# EAGLE design mainboard (EAGLE 7.1.0)
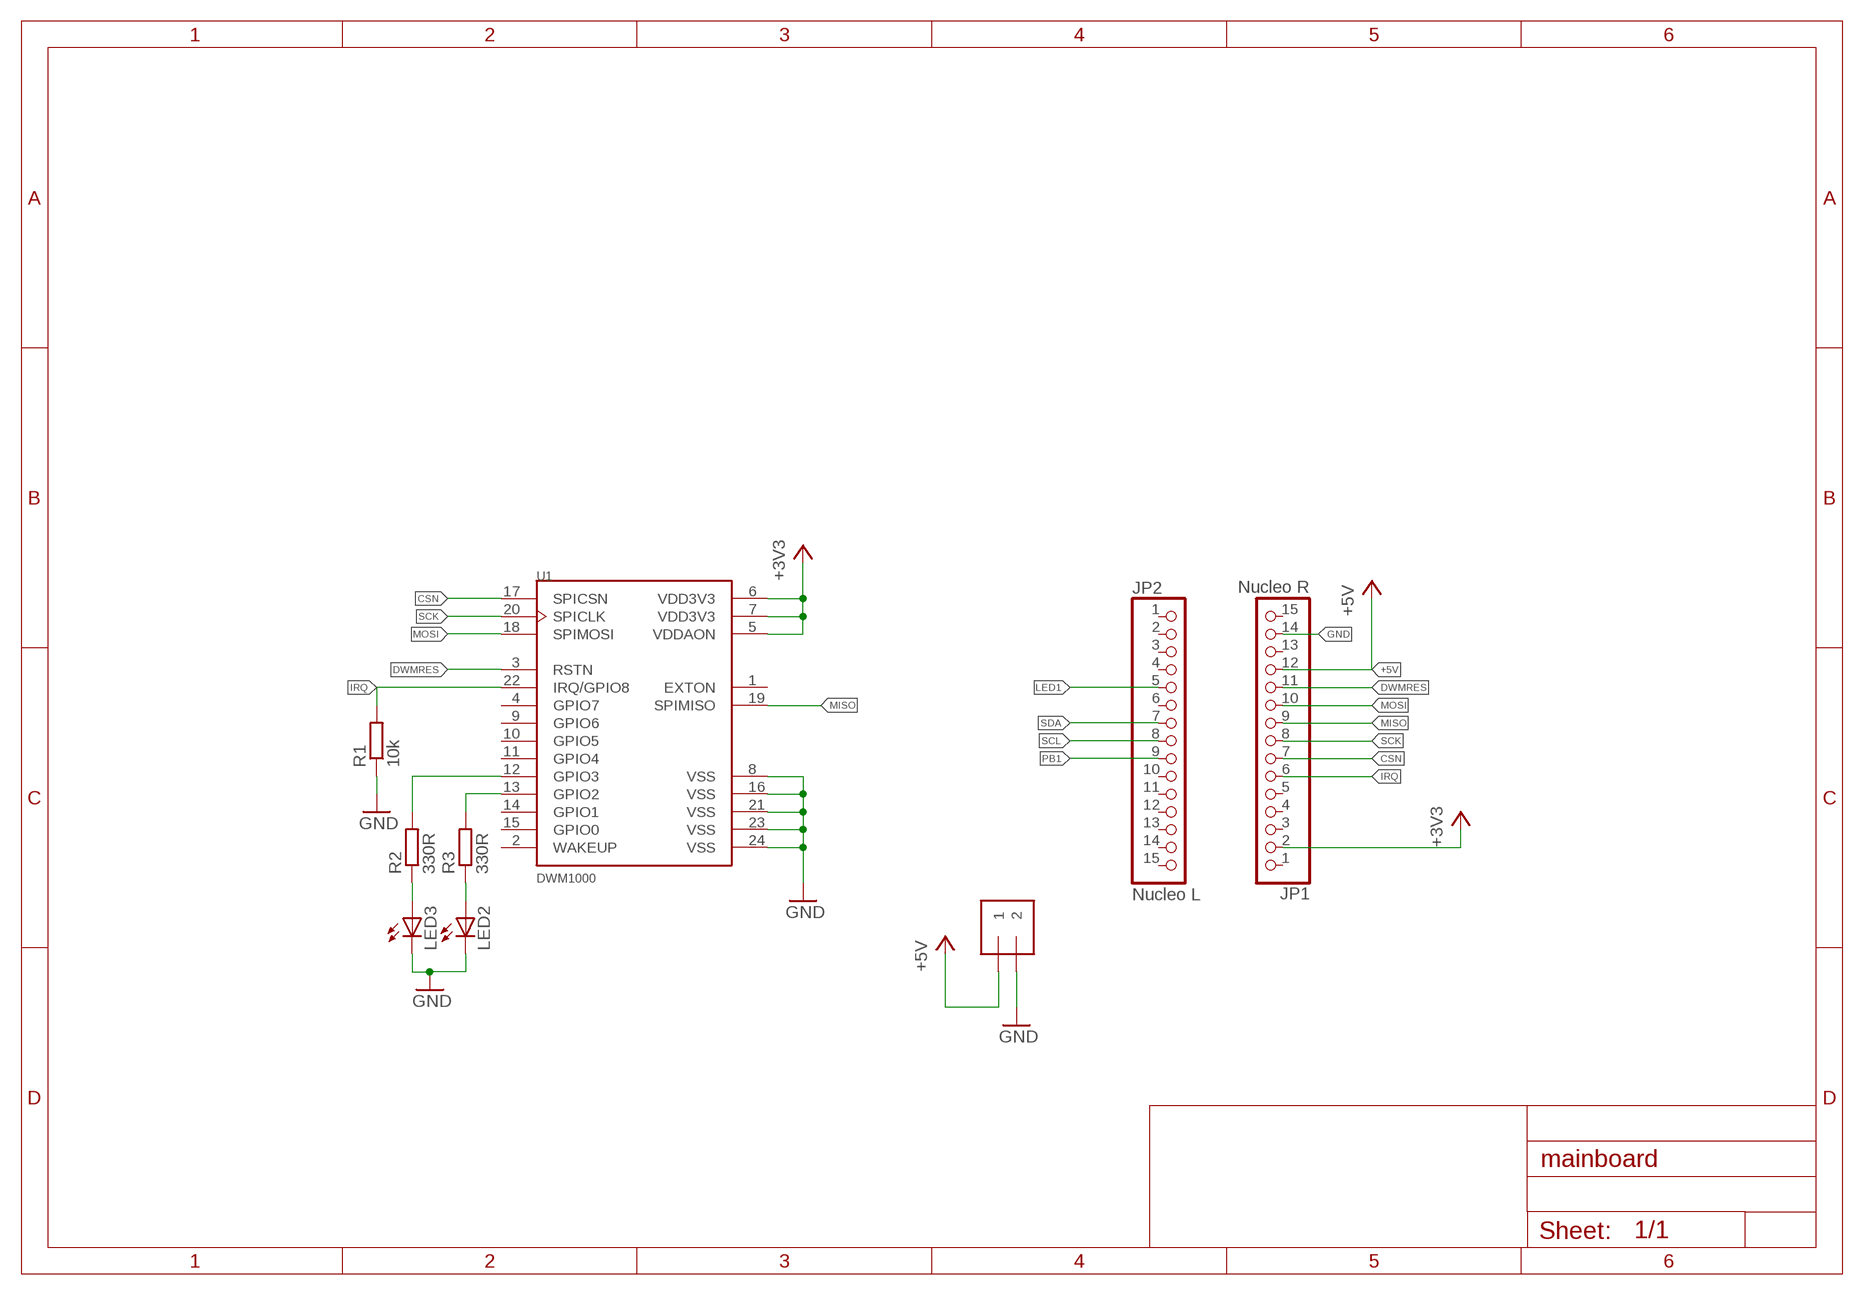
[diagram p0: schematic, sheet 1]

## Parts
J1  1X2-3.5MM  [1X2-3.5MM]
JP1  Nucleo R  PINHD-1X15  [1X15]
JP2  Nucleo L  PINHD-1X15  [1X15]
LED2  LEDSML0603  [SML0603]
LED3  LEDSML0603  [SML0603]
R1  10k  R-EU_R0603  [R0603]
R2  330R  R-EU_R0603  [R0603]
R3  330R  R-EU_R0603  [R0603]
U1  DWM1000  [XCVR_DWM1000]

## Nets
+3V3: JP1.2 U1.5(VDDAON) U1.6(VDD3V3) U1.7(VDD3V3)
+5V: J1.1 JP1.12
CSN: JP1.7 U1.17(SPICSN)
DWMRES: JP1.11 U1.3(RSTN)
GND: J1.2 JP1.14 LED2.C LED3.C R1.1 U1.8(VSS) U1.16(VSS) U1.21(VSS) U1.23(VSS) U1.24(VSS)
IRQ: JP1.6 R1.2 U1.22(IRQ/GPIO8)
LED1: JP2.5
MISO: JP1.9 U1.19(SPIMISO)
MOSI: JP1.10 U1.18(SPIMOSI)
N$2: R3.2 U1.13(GPIO2)
N$3: R2.2 U1.12(GPIO3)
N$5: LED2.A R3.1
N$6: LED3.A R2.1
PB1: JP2.9
SCK: JP1.8 U1.20(SPICLK)
SCL: JP2.8
SDA: JP2.7
Unconnected: JP1.1 JP1.3 JP1.4 JP1.5 JP1.13 JP1.15 JP2.1 JP2.2 JP2.3 JP2.4 JP2.6 JP2.10 JP2.11 JP2.12 JP2.13 JP2.14 JP2.15 U1.1(EXTON) U1.2(WAKEUP) U1.4(GPIO7) U1.9(GPIO6) U1.10(GPIO5) U1.11(GPIO4) U1.14(GPIO1) U1.15(GPIO0)

## Library data of the parts
J1 = adafruit:1X2: 3.5mm Terminal block http://www.ladyada.net/library/pcb/eaglelibrary.html
JP1 JP2 = pinhead:PINHD-1X15: PIN HEADER
LED2 LED3 = led:LED: LED OSRAM: - CHIPLED LG R971, LG N971, LY N971, LG Q971, LY Q971, LO R971, LY R971 LH N974, LH R974 LS Q976, LO Q976, LY Q976 LO Q996 - Hyper CHIPLED LW Q18S LB Q993, LB Q99A, LB R99A - SideLED LS A670, LO A670, LY A670, LG A670, LP A670 LB A673, LV A673, LT A673, LW A673 LH A674 LY A675 LS A676, LA A676, LO A676, LY A676, LW A676 LS A679, LY A679, LG A679 - Hyper Micro SIDELED® LS Y876, LA Y876, LO Y876, LY Y876 LT Y87S - SmartLED LW L88C, LW L88S LB L89C, LB L89S, LG L890 LS L89K, LO L89K, LY L89K LS L896, LA L896, LO L896, LY L896 - TOPLED LS T670, LO T670, LY T670, LG T670, LP T670 LSG T670, LSP T670, LSY T670, LOP T670, LYG T670 LG T671, LOG T671, LSG T671 LB T673, LV T673, LT T673, LW T673 LH T674 LS T676, LA T676, LO T676, LY T676, LB T676, LH T676, LSB T676, LW T676 LB T67C, LV T67C, LT T67C, LS T67K, LO T67K, LY T67K, LW E67C LS E67B, LA E67B, LO E67B, LY E67B, LB E67C, LV E67C, LT E67C LW T67C LS T679, LY T679, LG T679 LS T770, LO T770, LY T770, LG T770, LP T770 LB T773, LV T773, LT T773, LW T773 LH T774 LS E675, LA E675, LY E675, LS T675 LS T776, LA T776, LO T776, LY T776, LB T776 LHGB T686 LT T68C, LB T68C - Hyper Mini TOPLED® LB M676 - Mini TOPLED Santana® LG M470 LS M47K, LO M47K, LY M47K Source: http://www.osram.convergy.de LUXEON: - LUMILED® LXK2-PW12-R00, LXK2-PW12-S00, LXK2-PW14-U00, LXK2-PW14-V00 LXK2-PM12-R00, LXK2-PM12-S00, LXK2-PM14-U00 LXK2-PE12-Q00, LXK2-PE12-R00, LXK2-PE12-S00, LXK2-PE14-T00, LXK2-PE14-U00 LXK2-PB12-K00, LXK2-PB12-L00, LXK2-PB12-M00, LXK2-PB14-N00, LXK2-PB14-P00, LXK2-PB14-Q00 LXK2-PR12-L00, LXK2-PR12-M00, LXK2-PR14-Q00, LXK2-PR14-R00 LXK2-PD12-Q00, LXK2-PD12-R00, LXK2-PD12-S00 LXK2-PH12-R00, LXK2-PH12-S00 LXK2-PL12-P00, LXK2-PL12-Q00, LXK2-PL12-R00 Source: www.luxeon.com KINGBRIGHT: KA-3528ASYC Source: www.kingbright.com
R1-R3 = rcl:R-EU_: RESISTOR, European symbol
U1 = DWM1000:DWM1000: Mod Ieee802.15.4-2011 Uwb Txrx

## Net classes
0 default: clearance 0.205 mm

## Board
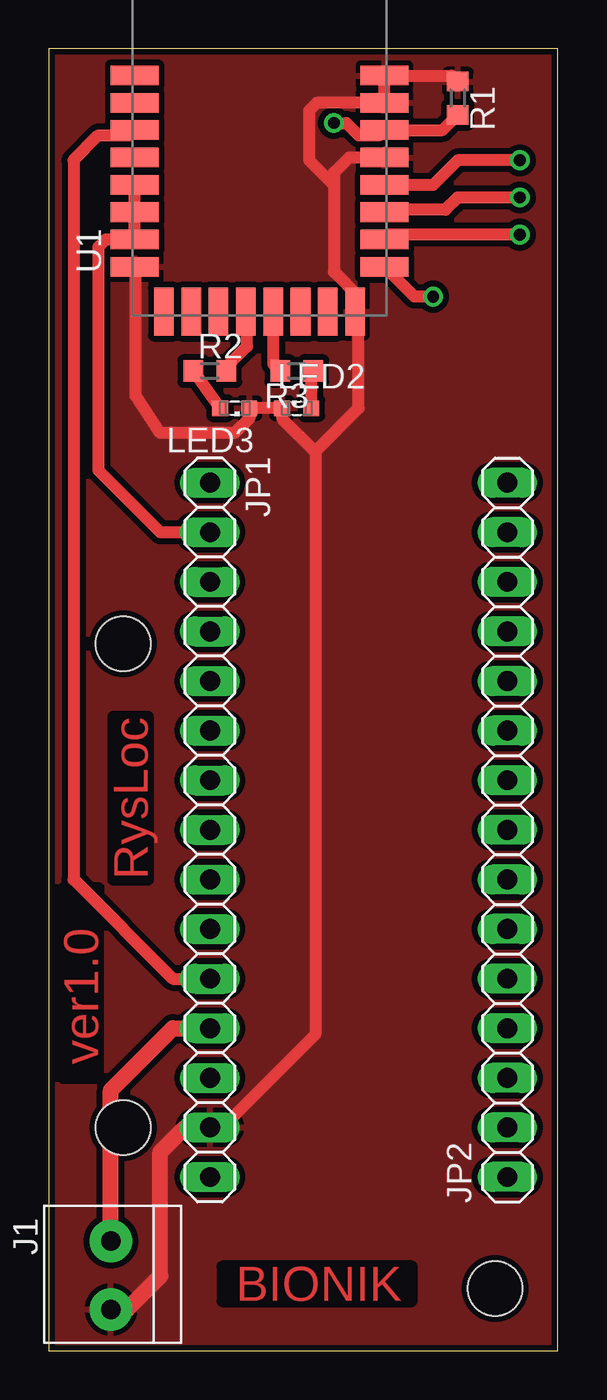
[diagram p1: board, top side]
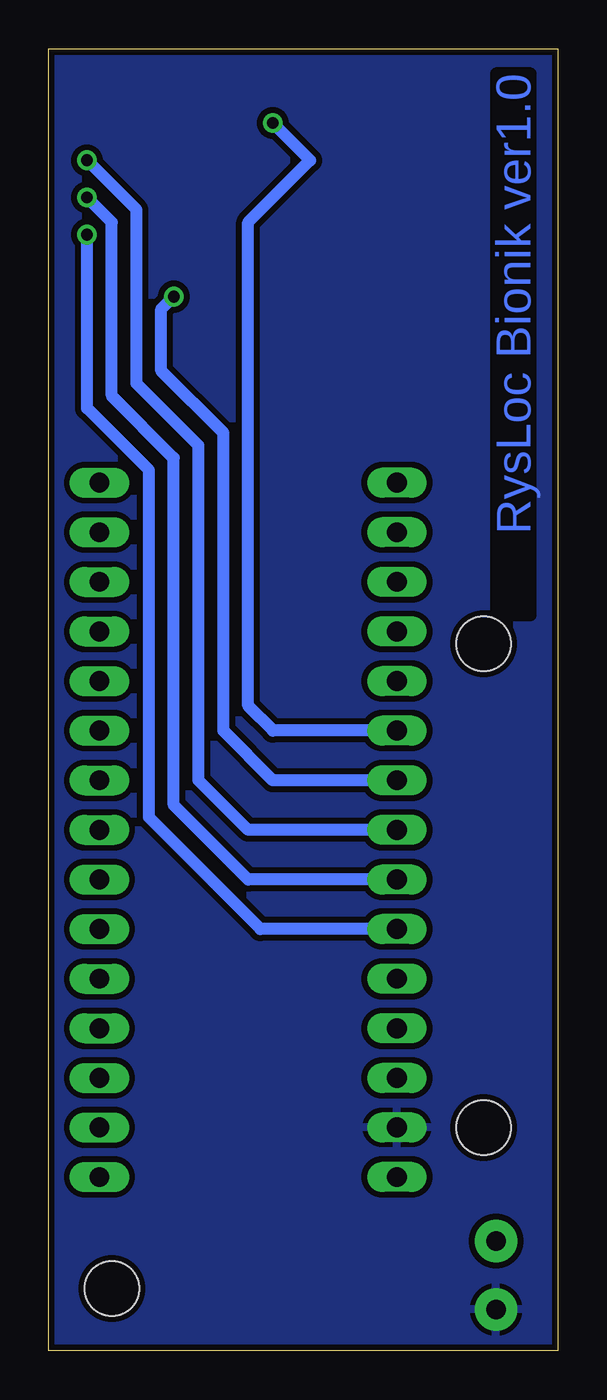
[diagram p2: board, bottom side, seen from below]

Size 26.09 x 66.66 mm. Coordinates in mm from the lower left corner, seen from the top.
Outline: 0,0 26.09,0 26.09,66.66 0,66.66 0,0
Copper layers (1*16): Top 0.035mm / dielectric 1.5mm / Bottom 0.035mm
Design rules "default *": minimum track width 10mil, minimum drill 24mil, track to track 8mil, track to pad 8mil, pad to pad 8mil, via to via 8mil, smd to smd 8mil, copper to edge 8mil, drill to drill 8mil, minimum pad ring 8mil, minimum via ring 8mil, stop-mask expansion 4mil, vias tented up to drill 0mil, thermal gap 10mil
Holes 2.8 mm at 22.86,3.17 3.81,36.2 3.81,11.43

### Footprints (pad centres in the part's own frame; a part is rotated, then mirrored left to right if it is on the bottom)
1X2-3.5MM = drill 1 pad 2.184: 1 1.8,0; 2 -1.7,0
1X15 = drill 1.016 long: 1 -17.78,0; 2 -15.24,0; 3 -12.7,0; 4 -10.16,0; 5 -7.62,0; 6 -5.08,0; 7 -2.54,0; 8 0,0; 9 2.54,0; 10 5.08,0; 11 7.62,0; 12 10.16,0; 13 12.7,0; 14 15.24,0; 15 17.78,0
SML0603 = smd 0.8 x 0.8: A 0.75,0; C -0.75,0
R0603 = smd 1 x 1.1: 1 -0.85,0; 2 0.85,0
XCVR_DWM1000 = smd 2.45 x 1: 1 -6.4,1.8; 2 -6.4,0.4; 3 -6.4,-1; 4 -6.4,-2.4; 5 -6.4,-3.8; 6 -6.4,-5.2; 7 -6.4,-6.6; 8 -6.4,-8; 17 6.4,-8; 18 6.4,-6.6; 19 6.4,-5.2; 20 6.4,-3.8; 21 6.4,-2.4; 22 6.4,-1; 23 6.4,0.4; 24 6.4,1.8 | smd 1 x 2.45: 9 -4.9,-10.295; 10 -3.5,-10.295; 11 -2.1,-10.295; 12 -0.7,-10.295; 13 0.7,-10.295; 14 2.1,-10.295; 15 3.5,-10.295; 16 4.9,-10.295

### Placement (x,y rotation side)
J1  3.18,3.81 90 top
JP1  8.26,26.67 270 top
JP2  23.5,26.67 90 top
LED2  12.7,48.26 0 top
LED3  9.53,48.26 180 top
R1  20.96,64.13 270 top
R2  8.26,50.16 0 top
R3  12.7,50.16 180 top
U1  10.8,63.5 0 top

### Tracks (layer width: path | path; a pad name or v marks a point on that pad's centre or on a via)
+3V3
  Top 0.61: U1.5 U1.6 U1.7 2.93,56.9 2.54,56.52 2.54,45.09 5.72,41.91 JP1.2
+5V
  Top 0.813: J1.1 3.18,13.33 6.35,16.51 JP1.12
CSN  (via drill 0.6)
  Top 0.61: v19.69,53.98 18.72,53.98 U1.17
  Bottom 0.61: v19.69,53.98 20.32,53.34 20.32,50.16 17.15,46.99 17.15,31.75 14.61,29.21 JP1.7
DWMRES
  Top 0.61: U1.3 4.12,62.23 2.54,62.23 1.27,60.96 1.27,24.13 6.35,19.05 JP1.11
GND
  Top 0.61: 13.65,46.04 15.88,48.26 15.88,53.03 U1.16 15.88,53.39 15.88,53.98 14.61,55.25 14.61,59.69 | U1.8 4.45,55.45 4.45,48.9 5.72,46.99 9.53,46.99 10.28,47.74 LED3.C LED2.C 11.95,47.74 13.65,46.04 | U1.21 15.38,61.1 14.61,60.32 14.61,59.69 | 14.61,59.69 13.34,60.96 13.34,63.5 13.74,63.9 U1.23 U1.24 20.64,65.3 R1.1 | 13.65,46.04 13.65,16.19 8.89,11.43 JP1.14
  Top 0.813: J1.2 4.02,2.11 5.72,3.81 5.72,10.16 6.99,11.43 JP1.14
  pour Top (isolate 0.305): 0,66.67 0,0 26.04,0 26.04,66.67
  pour Bottom (isolate 0.305): 0,66.67 0,0 26.04,0 26.04,66.67
IRQ  (via drill 0.6)
  Top 0.61: v14.61,62.87 15.24,62.87 15.88,62.23 16.93,62.23 U1.22 20.17,62.5 R1.2
  Bottom 0.61: v14.61,62.87 12.7,60.96 15.88,57.79 15.88,33.02 14.61,31.75 JP1.6
MISO  (via drill 0.6)
  Top 0.61: v24.13,59.05 20.96,59.05 20.32,58.42 17.32,58.42 U1.19
  Bottom 0.61: v24.13,59.05 22.86,57.79 22.86,48.9 19.69,45.72 19.69,27.94 15.88,24.13 JP1.9
MOSI  (via drill 0.6)
  Top 0.61: v24.13,57.15 17.45,57.15 U1.18
  Bottom 0.61: JP1.10 15.24,21.59 20.96,27.3 20.96,45.09 24.13,48.26 v24.13,57.15
N$2
  Top 0.61: U1.13 11.5,50.52 R3.2
N$3
  Top 0.61: R2.2 9.11,50.38 10.16,51.44 10.16,53.14 U1.12
N$5
  Top 0.61: LED2.A 13.45,50.07 R3.1
N$6
  Top 0.61: LED3.A 7.51,50.07 R2.1
SCK  (via drill 0.6)
  Top 0.61: v24.13,60.96 20.96,60.96 19.69,59.69 U1.20
  Bottom 0.61: v24.13,60.96 21.59,58.42 21.59,49.53 18.42,46.36 18.42,29.21 15.88,26.67 JP1.8

### Text on the board
Top: RysLoc | ver1.0 | BIONIK
Bottom: RysLoc Bionik ver1.0